# Altium schematic sheet SH1 - STM32.SchDoc
size Letter
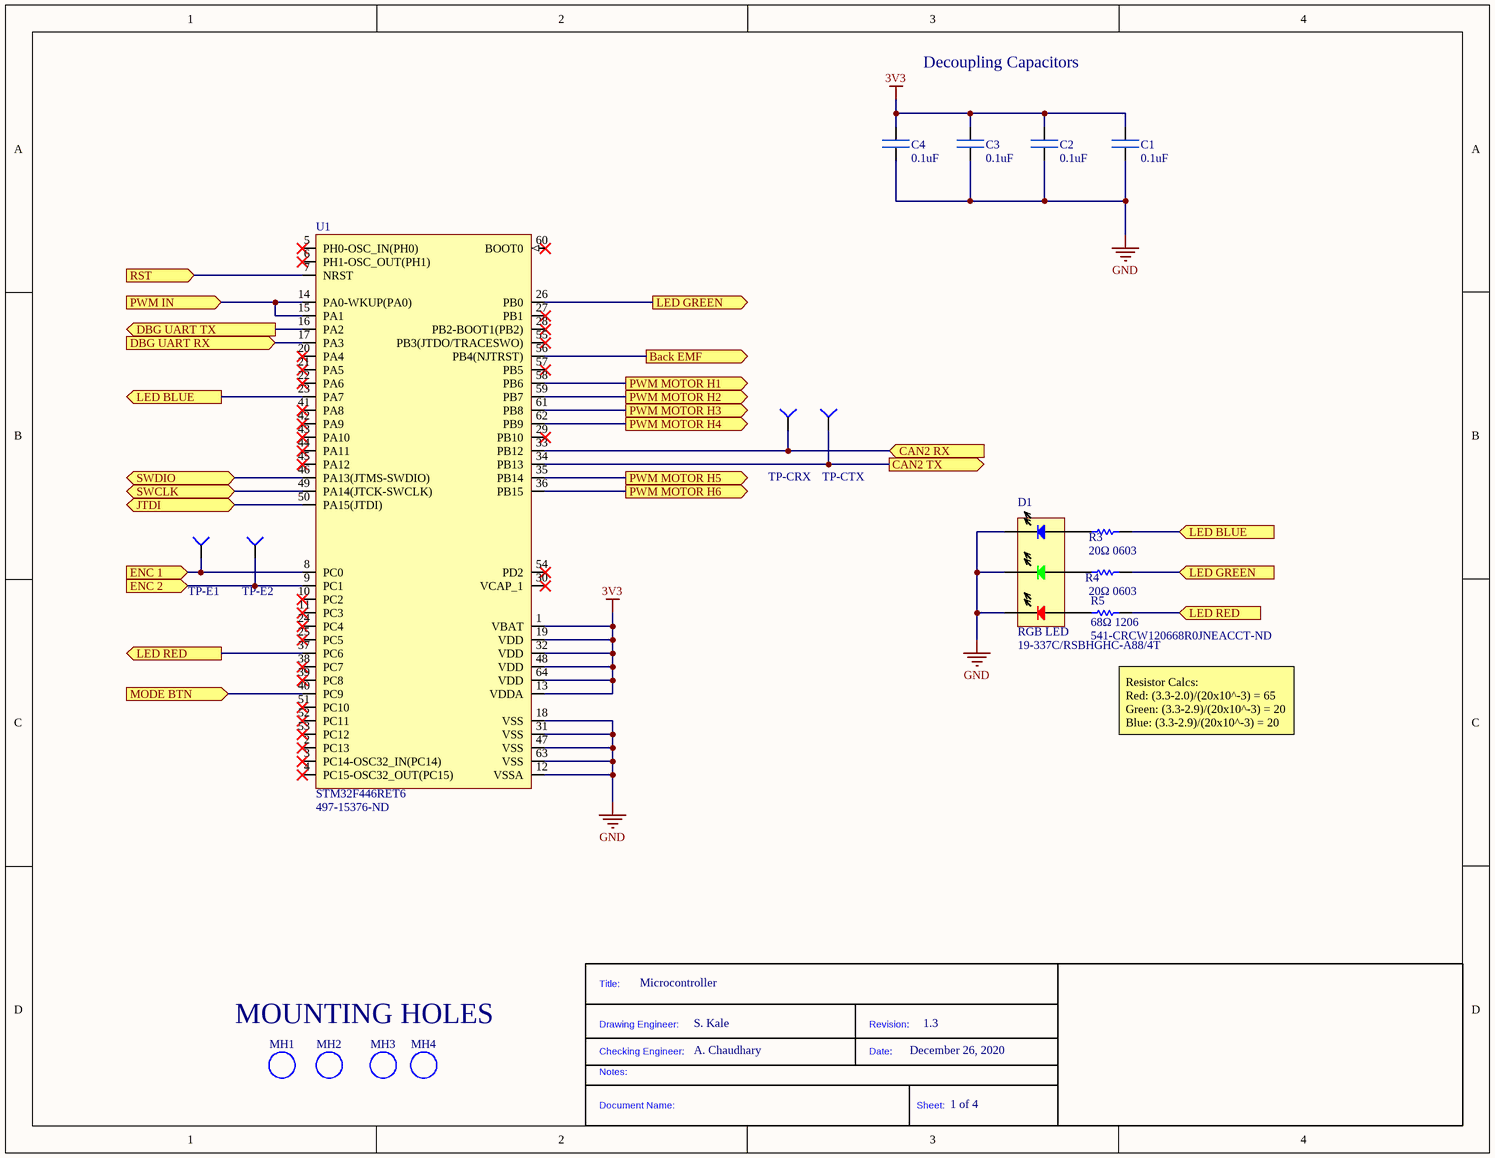
[diagram p0: SH1 - STM32.SchDoc]

## Parts
*  HORNET LOGO  (value not drawn)  (graphical)
?  TitleBlock  (value not drawn)  (graphical)
C1  0.1uF  [CAP0.1uF]
C2  0.1uF  [CAP0.1uF]
C3  0.1uF  [CAP0.1uF]
C4  0.1uF  [CAP0.1uF]
D1  RGB LED  [19-337C/RSBHGHC-A88/4T]
MH1  MOUNTING HOLE  [MOUNTING HOLE]  (value not drawn)
MH2  MOUNTING HOLE  [MOUNTING HOLE]  (value not drawn)
MH3  MOUNTING HOLE  [MOUNTING HOLE]  (value not drawn)
MH4  MOUNTING HOLE  [MOUNTING HOLE]  (value not drawn)
R3  20Ω 0603  [SDR03EZPJ200]
R4  20Ω 0603  [SDR03EZPJ200]
R5  68Ω 1206  Supplier Part Number 1: 541-CRCW120668R0JNEACCT-ND  [CRCW120668R0JNEAC]
TP-CRX  TESTPT  [TESTPT SQUARE]  (value not drawn)
TP-CTX  TESTPT  [TESTPT SQUARE]  (value not drawn)
TP-E1  TESTPT  [TESTPT SQUARE]  (value not drawn)
TP-E2  TESTPT  [TESTPT SQUARE]  (value not drawn)
U1  STM32F446RET6  Supplier Part Number 1: 497-15376-ND  [STM_LQFP64_N]

## Ports
Back EMF (out), CAN2 RX (in), CAN2 TX (out), DBG UART RX (in), DBG UART TX (out), ENC 1 (in), ENC 2 (in), JTDI (bidir), LED BLUE (in), LED BLUE (out), LED GREEN (in), LED GREEN (out), LED RED (in), LED RED (out), MODE BTN (in), PWM IN (in), PWM MOTOR H1 (out), PWM MOTOR H2 (out), PWM MOTOR H3 (out), PWM MOTOR H4 (out), PWM MOTOR H5 (out), PWM MOTOR H6 (out), RST (in), SWCLK (bidir), SWDIO (bidir)

## Nets
3V3: C1.2 C2.2 C3.2 C4.2 U1.1(VBAT) U1.13(VDDA) U1.19(VDD) U1.32(VDD) U1.48(VDD) U1.64(VDD)
GND: C1.1 C2.1 C3.1 C4.1 D1.1(GREEN_-) D1.3(RED_-) D1.5(BLUE_-) U1.12(VSSA) U1.18(VSS) U1.31(VSS) U1.47(VSS) U1.63(VSS)
Back EMF: U1.56(PB4(NJTRST)) ; port Back EMF
CAN2 RX: TP-CRX.1(=value) U1.33(PB12) ; port CAN2 RX
CAN2 TX: TP-CTX.1(=value) U1.34(PB13) ; port CAN2 TX
DBG UART RX: U1.17(PA3) ; port DBG UART RX
DBG UART TX: U1.16(PA2) ; port DBG UART TX
ENC 1: TP-E1.1(=value) U1.8(PC0) ; port ENC 1
ENC 2: TP-E2.1(=value) U1.9(PC1) ; port ENC 2
JTDI: U1.50(PA15(JTDI)) ; port JTDI
LED BLUE: R3.2 U1.23(PA7) ; port LED BLUE
LED GREEN: R4.2 U1.26(PB0) ; port LED GREEN
LED RED: R5.2 U1.37(PC6) ; port LED RED
MODE BTN: U1.40(PC9) ; port MODE BTN
PWM IN: U1.14(PA0-WKUP(PA0)) U1.15(PA1) ; port PWM IN
PWM MOTOR H1: U1.58(PB6) ; port PWM MOTOR H1
PWM MOTOR H2: U1.59(PB7) ; port PWM MOTOR H2
PWM MOTOR H3: U1.61(PB8) ; port PWM MOTOR H3
PWM MOTOR H4: U1.62(PB9) ; port PWM MOTOR H4
PWM MOTOR H5: U1.35(PB14) ; port PWM MOTOR H5
PWM MOTOR H6: U1.36(PB15) ; port PWM MOTOR H6
RST: U1.7(NRST) ; port RST
SWCLK: U1.49(PA14(JTCK-SWCLK)) ; port SWCLK
SWDIO: U1.46(PA13(JTMS-SWDIO)) ; port SWDIO
NetD1_2: D1.2(Green_+) R4.1
NetD1_4: D1.4(Red_+) R5.1
NetD1_6: D1.6(Blue_+) R3.1

Not connected (* = marked no-connect by the designer): U1 2(PC13)* 3(PC14-OSC32_IN(PC14))* 4(PC15-OSC32_OUT(PC15))* 5(PH0-OSC_IN(PH0))* 6(PH1-OSC_OUT(PH1))* 10(PC2)* 11(PC3)* 20(PA4)* 21(PA5)* 22(PA6)* 24(PC4)* 25(PC5)* 27(PB1)* 28(PB2-BOOT1(PB2))* 29(PB10)* 30(VCAP_1)* 38(PC7)* 39(PC8)* 41(PA8)* 42(PA9)* 43(PA10)* 44(PA11)* 45(PA12)* 51(PC10)* 52(PC11)* 53(PC12)* 54(PD2)* 55(PB3(JTDO/TRACESWO))* 57(PB5)* 60(BOOT0)*

## Notes on the sheet
- Decoupling Capacitors
- Resistor Calcs:
  Red: (3.3-2.0)/(20x10^-3) = 65
  Green: (3.3-2.9)/(20x10^-3) = 20
  Blue: (3.3-2.9)/(20x10^-3) = 20
- MOUNTING HOLES
- Microcontroller
- S. Kale
- 1.3
- A. Chaudhary
- December 26, 2020
- 1 of 4
- (in symbol TitleBlock) Title:; Drawing Engineer:; Revision:; Checking Engineer:; Date:; Notes:; Document Name:; Sheet:

## Library data of the parts
? = TitleBlock: Standard Title Block
C1-C4 = CAP 0.1uF: Ceramic Capacitor, Multilayer, Ceramic, 16V, 10% +Tol, 10% -Tol, X7R, 15% TC, 0.1uF, Surface Mount, 0402; Manufacturer: Murata; Manufacturer Part Number: GRM155R71C104KA88D; Capacitance: 100nF; Multilayer: Yes; Supplier 1: Digi-Key; RoHS: Yes; Category: Ceramic Capacitors; Stock 1: 19996896; Pricing 1: 1=0.10000, 10=0.02100, 50=0.01140, 100=0.00930, 500=0.00666, 1000=0.00523, 2500=0.00476, 5000=0.00438 (USD); Mount: Surface Mount; Number of Pins: 2; Dielectric Material: Ceramic; Size Code: 0402; Terminal Finish: Nickel; Package Shape: Rectangular; Min Operating Temperature: -55°C; Max Operating Temperature: 125°C; JESD-609 Code: e3; Capacitor Type: Ceramic; Negative Tolerance: 10%; Packaging: Tape and Reel; Positive Tolerance: 10%; Rated DC Voltage (URdc): 16V; Temperature Characteristics Code: X7R; Termination: Wraparound; Package Style: SMTMeter; Length: 1mm; Width: 0.5mm; ComponentLink1URL: https://psearch.en.murata.com:443/capacitor/product/GRM155R71C104KA88%23.pdf?src-supplier=IHS+Markit; ComponentLink1Description: https://psearch.en.murata.com:443/capacitor/product/GRM155R71C104KA88%23.pdf?src-supplier=IHS+Markit; ComponentLink2URL: https://datasheet.ciiva.com/129/grm155r71c104ka88-01-129740.pdf?src-supplier=Digi-Key; ComponentLink2Description: https://datasheet.ciiva.com/129/grm155r71c104ka88-01-129740.pdf?src-supplier=Digi-Key; ComponentLink3URL: https://datasheet.ciiva.com/18102/getdatasheetpartid-85307-18102905.pdf?src-supplier=Verical; ComponentLink3Description: https://datasheet.ciiva.com/18102/getdatasheetpartid-85307-18102905.pdf?src-supplier=Verical; ComponentLink4URL: https://datasheet.ciiva.com/129/grm155r71c104ka88-01-129739.pdf?src-supplier=Digi-Key; ComponentLink4Description: https://datasheet.ciiva.com/129/grm155r71c104ka88-01-129739.pdf?src-supplier=Digi-Key; ComponentLink5URL: https://datasheet.ciiva.com/29199/454098-da-01-en-vs-kondensator-0402-29199799.pdf?src-supplier=Conrad; ComponentLink5Description: https://datasheet.ciiva.com/29199/454098-da-01-en-vs-kondensator-0402-29199799.pdf?src-supplier=Conrad; ComponentLink6URL: https://datasheet.ciiva.com/28534/4360-28534133.pdf?src-supplier=Element14; ComponentLink6Description: https://datasheet.ciiva.com/28534/4360-28534133.pdf?src-supplier=Element14; ComponentLink7URL: https://datasheet.ciiva.com/14103/grmseries-highdielectrictype-eng-14103750.pdf?src-supplier=Distrelec; ComponentLink7Description: https://datasheet.ciiva.com/14103/grmseries-highdielectrictype-eng-14103750.pdf?src-supplier=Distrelec; ComponentLink8URL: https://datasheet.ciiva.com/16199/product-16199000.pdf?src-supplier=Future+Electronics; ComponentLink8Description: https://datasheet.ciiva.com/16199/product-16199000.pdf?src-supplier=Future+Electronics; ComponentLink9URL: https://datasheet.ciiva.com/14116/grmseries-highdielectrictype-eng-14116878.pdf?src-supplier=Distrelec; ComponentLink9Description: https://datasheet.ciiva.com/14116/grmseries-highdielectrictype-eng-14116878.pdf?src-supplier=Distrelec; ComponentLink10URL: https://datasheet.ciiva.com/7937/4360-7937615.pdf?src-supplier=Element14; ComponentLink10Description: https://datasheet.ciiva.com/7937/4360-7937615.pdf?src-supplier=Element14; ComponentLink11URL: https://datasheet.ciiva.com/28534/4360-28534127.pdf?src-supplier=Element14; ComponentLink11Description: https://datasheet.ciiva.com/28534/4360-28534127.pdf?src-supplier=Element14; Height: 0.5mm; Supplier Part Number 1: 490-3261-1-ND
D1 = LED_RGB: Tri Color Pcb Top View SMD Led R; Manufacturer: Everlight; Supplier 1: Digi-Key; Manufacturer Part Number: 19-337C/RSBHGHC-A88/4T; RoHS: No; Category: LEDs; Stock 1: 109225; Pricing 1: 1=0.40000, 10=0.24400, 100=0.14030, 1000=0.10980, 2000=0.10065 (USD); Supplier Part Number 1: 1080-1631-1-ND
R3 R4 = RES 20Ω: Fixed Resistor, 0.1W, 20ohm, 50V, 5% +/-Tol, 200ppm/Cel, Surface Mount, 0603; Manufacturer: Rohm; Additional Feature: ANTI-SULFUR; Rated Power Dissipation (P): 100mW; Rated Temperature: 70°C; Resistance: 20R; Temperature Coefficient: 200ppm/°C; Reference Standard: TS 16949; Supplier 1: Digi-Key; Manufacturer Part Number: SDR03EZPJ200; RoHS: No; Category: Chip SMD Resistors; Stock 1: 3900; Pricing 1: 1=0.10000, 10=0.07300, 100=0.02800, 1000=0.01232, 2500=0.01064 (USD); Mount: Surface Mount; Number of Pins: 2; Package Shape: Rectangular; Size Code: 0603; Min Operating Temperature: -55°C; Max Operating Temperature: 155°C; Tolerance: 5%; Resistor Type: FIXED RESISTOR; Packaging: Tape and Reel; Termination: Wraparound; Working Voltage: 50V; ComponentLink1URL: https://datasheet.ciiva.com:443/pdfs/VipMasterIC/IC/ROHM/ROHM-S-A0002832543/ROHM-S-A0002832543-1.pdf?src-supplier=IHS+Markit; ComponentLink1Description: https://datasheet.ciiva.com:443/pdfs/VipMasterIC/IC/ROHM/ROHM-S-A0002832543/ROHM-S-A0002832543-1.pdf?src-supplier=IHS+Markit; ComponentLink2URL: https://www.rohm.com/datasheet/SDR03EZPJ/sdr-e?src-supplier=Digi-Key; ComponentLink2Description: https://www.rohm.com/datasheet/SDR03EZPJ/sdr-e?src-supplier=Digi-Key; Supplier Part Number 1: 511-1747-1-ND
R5 = RES 68Ω: VISCRCW120668R0JNEAC Res Thick Film 1206; Manufacturer: Vishay; Tolerance: 5%; Rated Power Dissipation (P): 250mW; Resistance: 68R; Temperature Coefficient: -200200ppm/°C; Working Voltage: 200V; Package Height: 0.55mm; Package Length: 3.05mm; Package Width: 1.55mm; Supplier 1: Digi-Key; Manufacturer Part Number: CRCW120668R0JNEAC; Stock 1: 24990; Pricing 1: 1=0.10000, 10=0.06300, 100=0.02570, 1000=0.01153, 2500=0.01000 (USD); Number of Pins: 2; Size Code: 1206; Terminal Finish: Nickel; Min Operating Temperature: -55°C; Max Operating Temperature: 155°C; JESD-609 Code: e3; Resistor Type: FIXED RESISTOR; Construction: Chip; Package Style: SMTMeter; Packaging: Tape and Reel; Technology: METAL GLAZE/THICK FILM; ComponentLink1URL: https://datasheet.ciiva.com:443/pdfs/VipMasterIC/IC/VISH/VISH-S-A0003599164/VISH-S-A0003599164-1.pdf?src-supplier=IHS+Markit; ComponentLink1Description: https://datasheet.ciiva.com:443/pdfs/VipMasterIC/IC/VISH/VISH-S-A0003599164/VISH-S-A0003599164-1.pdf?src-supplier=IHS+Markit
TP-CRX TP-CTX TP-E1 TP-E2 = TESTPT SQUARE
U1 = STM32F446RET6: RISC Microcontroller, 32-Bit, FLASH, CORTEX-M4F CPU, 180MHz, CMOS, PQFP64; Manufacturer: STMicroelectronics; Package Body Material: Plastic; Package Equivalence Code: QFP64,.47SQ,20; Power Supplies: 1.8/3.3V; Speed: 180RPM; Max Supply Current: 115mA; Qualification Status: Not Qualified; Parameter 1: *; Supplier 1: Digi-Key; Manufacturer Part Number: STM32F446RET6; RoHS: Yes; Category: Microcontrollers; Pricing 1: 1=9.05000, 10=8.17300, 25=7.79320, 160=6.76675, 320=6.46266, 480=5.89242, 960=5.13210, 2400=4.94202, 4960=4.75194 (USD); Package Code: QFP; Number of Pins: 64; Package Shape: Square; Min Operating Temperature: -40°C; Max Operating Temperature: 85°C; JESD-30 Code: S-PQFP-G64; Package Style: FLATPACKMeter; Surface Mount: Yes; Technology: CMOS; Terminal Form: Gull Wing; Terminal Position: QUAD; Terminal Pitch: 0.5mm; Temperature Grade: INDUSTRIAL; ComponentLink1URL: https://datasheet.ciiva.com:443/pdfs/VipMasterIC/IC/SGST/SGST-S-A0000954157/SGST-S-A0000954273-1.pdf?src-supplier=IHS+Markit; ComponentLink1Description: https://datasheet.ciiva.com:443/pdfs/VipMasterIC/IC/SGST/SGST-S-A0000954157/SGST-S-A0000954273-1.pdf?src-supplier=IHS+Markit; ComponentLink2URL: http://www.farnell.com/datasheets/2309063.pdf?src-supplier=Farnell; ComponentLink2Description: http://www.farnell.com/datasheets/2309063.pdf?src-supplier=Farnell; ComponentLink3URL: http://www.mouser.com/ds/2/389/stm32f446mc-956216.pdf?src-supplier=Mouser; ComponentLink3Description: http://www.mouser.com/ds/2/389/stm32f446mc-956216.pdf?src-supplier=Mouser; ComponentLink4URL: http://www.farnell.com/datasheets/2309063.pdf?src-supplier=Newark; ComponentLink4Description: http://www.farnell.com/datasheets/2309063.pdf?src-supplier=Newark; ComponentLink5URL: http://www.st.com/content/ccc/resource/technical/document/datasheet/65/cb/75/50/53/d6/48/24/DM00141306.pdf/files/DM00141306.pdf/jcr:content/translations/en.DM00141306.pdf?src-supplier=Digi-Key; ComponentLink5Description: http://www.st.com/content/ccc/resource/technical/document/datasheet/65/cb/75/50/53/d6/48/24/DM00141306.pdf/files/DM00141306.pdf/jcr:content/translations/en.DM00141306.pdf?src-supplier=Digi-Key; ComponentLink6URL: http://www.farnell.com/datasheets/2309063.pdf?src-supplier=Element14; ComponentLink6Description: http://www.farnell.com/datasheets/2309063.pdf?src-supplier=Element14